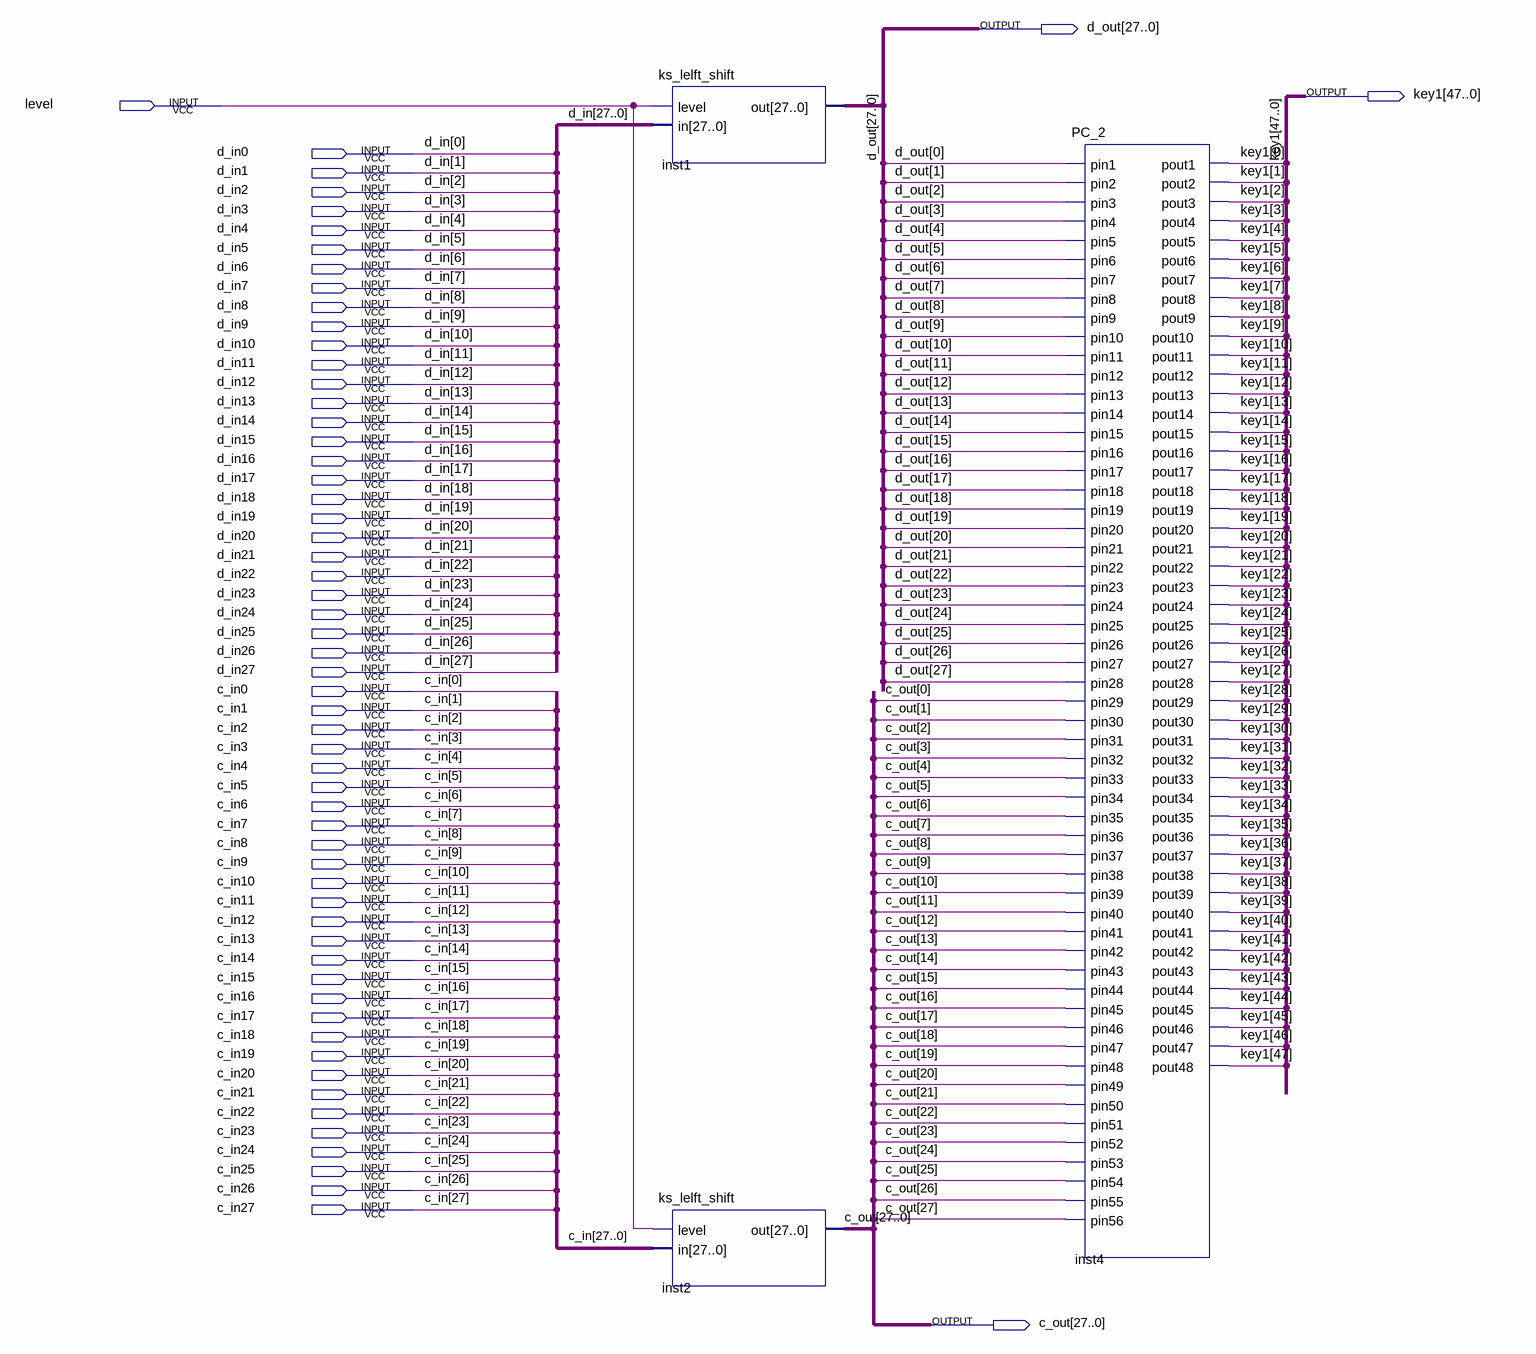
[diagram p0: schematic sheet]
// Quartus schematic round1_key.bdf as structural Verilog: 3 symbols, 60 pins
module round1_key (
  input  level,
  input  d_in0,
  input  d_in1,
  input  d_in2,
  input  d_in3,
  input  d_in4,
  input  d_in5,
  input  d_in6,
  input  d_in7,
  input  d_in8,
  input  d_in9,
  input  d_in10,
  input  d_in11,
  input  d_in12,
  input  d_in13,
  input  d_in14,
  input  d_in15,
  input  d_in16,
  input  d_in17,
  input  d_in18,
  input  d_in19,
  input  d_in20,
  input  d_in21,
  input  d_in22,
  input  d_in23,
  input  d_in24,
  input  d_in25,
  input  d_in26,
  input  d_in27,
  input  c_in0,
  input  c_in1,
  input  c_in2,
  input  c_in3,
  input  c_in4,
  input  c_in5,
  input  c_in6,
  input  c_in7,
  input  c_in8,
  input  c_in9,
  input  c_in10,
  input  c_in11,
  input  c_in12,
  input  c_in13,
  input  c_in14,
  input  c_in15,
  input  c_in16,
  input  c_in17,
  input  c_in18,
  input  c_in19,
  input  c_in20,
  input  c_in21,
  input  c_in22,
  input  c_in23,
  input  c_in24,
  input  c_in25,
  input  c_in26,
  input  c_in27,
  output [27:0] d_out,
  output [47:0] key1,
  output [27:0] c_out
);

  ks_lelft_shift inst1 (
    .level(level),
    .in({d_in27, d_in26, d_in25, d_in24, d_in23, d_in22, d_in21, d_in20, d_in19, d_in18, d_in17, d_in16, d_in15, d_in14, d_in13, d_in12, d_in11, d_in10, d_in9, d_in8, d_in7, d_in6, d_in5, d_in4, d_in3, d_in2, d_in1, d_in0}),
    .out(d_out));
  ks_lelft_shift inst2 (
    .level(level),
    .in({c_in27, c_in26, c_in25, c_in24, c_in23, c_in22, c_in21, c_in20, c_in19, c_in18, c_in17, c_in16, c_in15, c_in14, c_in13, c_in12, c_in11, c_in10, c_in9, c_in8, c_in7, c_in6, c_in5, c_in4, c_in3, c_in2, c_in1, c_in0}),
    .out(c_out));
  PC_2 inst4 (
    .pin1(d_out[0]), .pin2(d_out[1]), .pin3(d_out[2]), .pin4(d_out[3]), .pin5(d_out[4]), .pin6(d_out[5]),
    .pin7(d_out[6]), .pin8(d_out[7]), .pin9(d_out[8]), .pin10(d_out[9]), .pin11(d_out[10]),
    .pin12(d_out[11]), .pin13(d_out[12]), .pin14(d_out[13]), .pin15(d_out[14]), .pin16(d_out[15]),
    .pin17(d_out[16]), .pin18(d_out[17]), .pin19(d_out[18]), .pin20(d_out[19]), .pin21(d_out[20]),
    .pin22(d_out[21]), .pin23(d_out[22]), .pin24(d_out[23]), .pin25(d_out[24]), .pin26(d_out[25]),
    .pin27(d_out[26]), .pin28(d_out[27]), .pin29(c_out[0]), .pin30(c_out[1]), .pin31(c_out[2]),
    .pin32(c_out[3]), .pin33(c_out[4]), .pin34(c_out[5]), .pin35(c_out[6]), .pin36(c_out[7]),
    .pin37(c_out[8]), .pin38(c_out[9]), .pin39(c_out[10]), .pin40(c_out[11]), .pin41(c_out[12]),
    .pin42(c_out[13]), .pin43(c_out[14]), .pin44(c_out[15]), .pin45(c_out[16]), .pin46(c_out[17]),
    .pin47(c_out[18]), .pin48(c_out[19]), .pin49(c_out[20]), .pin50(c_out[21]), .pin51(c_out[22]),
    .pin52(c_out[23]), .pin53(c_out[24]), .pin54(c_out[25]), .pin55(c_out[26]), .pin56(c_out[27]),
    .pout1(key1[0]), .pout2(key1[1]), .pout3(key1[2]), .pout4(key1[3]), .pout5(key1[4]), .pout6(key1[5]),
    .pout7(key1[6]), .pout8(key1[7]), .pout9(key1[8]), .pout10(key1[9]), .pout11(key1[10]),
    .pout12(key1[11]), .pout13(key1[12]), .pout14(key1[13]), .pout15(key1[14]), .pout16(key1[15]),
    .pout17(key1[16]), .pout18(key1[17]), .pout19(key1[18]), .pout20(key1[19]), .pout21(key1[20]),
    .pout22(key1[21]), .pout23(key1[22]), .pout24(key1[23]), .pout25(key1[24]), .pout26(key1[25]),
    .pout27(key1[26]), .pout28(key1[27]), .pout29(key1[28]), .pout30(key1[29]), .pout31(key1[30]),
    .pout32(key1[31]), .pout33(key1[32]), .pout34(key1[33]), .pout35(key1[34]), .pout36(key1[35]),
    .pout37(key1[36]), .pout38(key1[37]), .pout39(key1[38]), .pout40(key1[39]), .pout41(key1[40]),
    .pout42(key1[41]), .pout43(key1[42]), .pout44(key1[43]), .pout45(key1[44]), .pout46(key1[45]),
    .pout47(key1[46]), .pout48(key1[47]));
endmodule
